# EAGLE design relay-v1 (EAGLE 7.7.0)
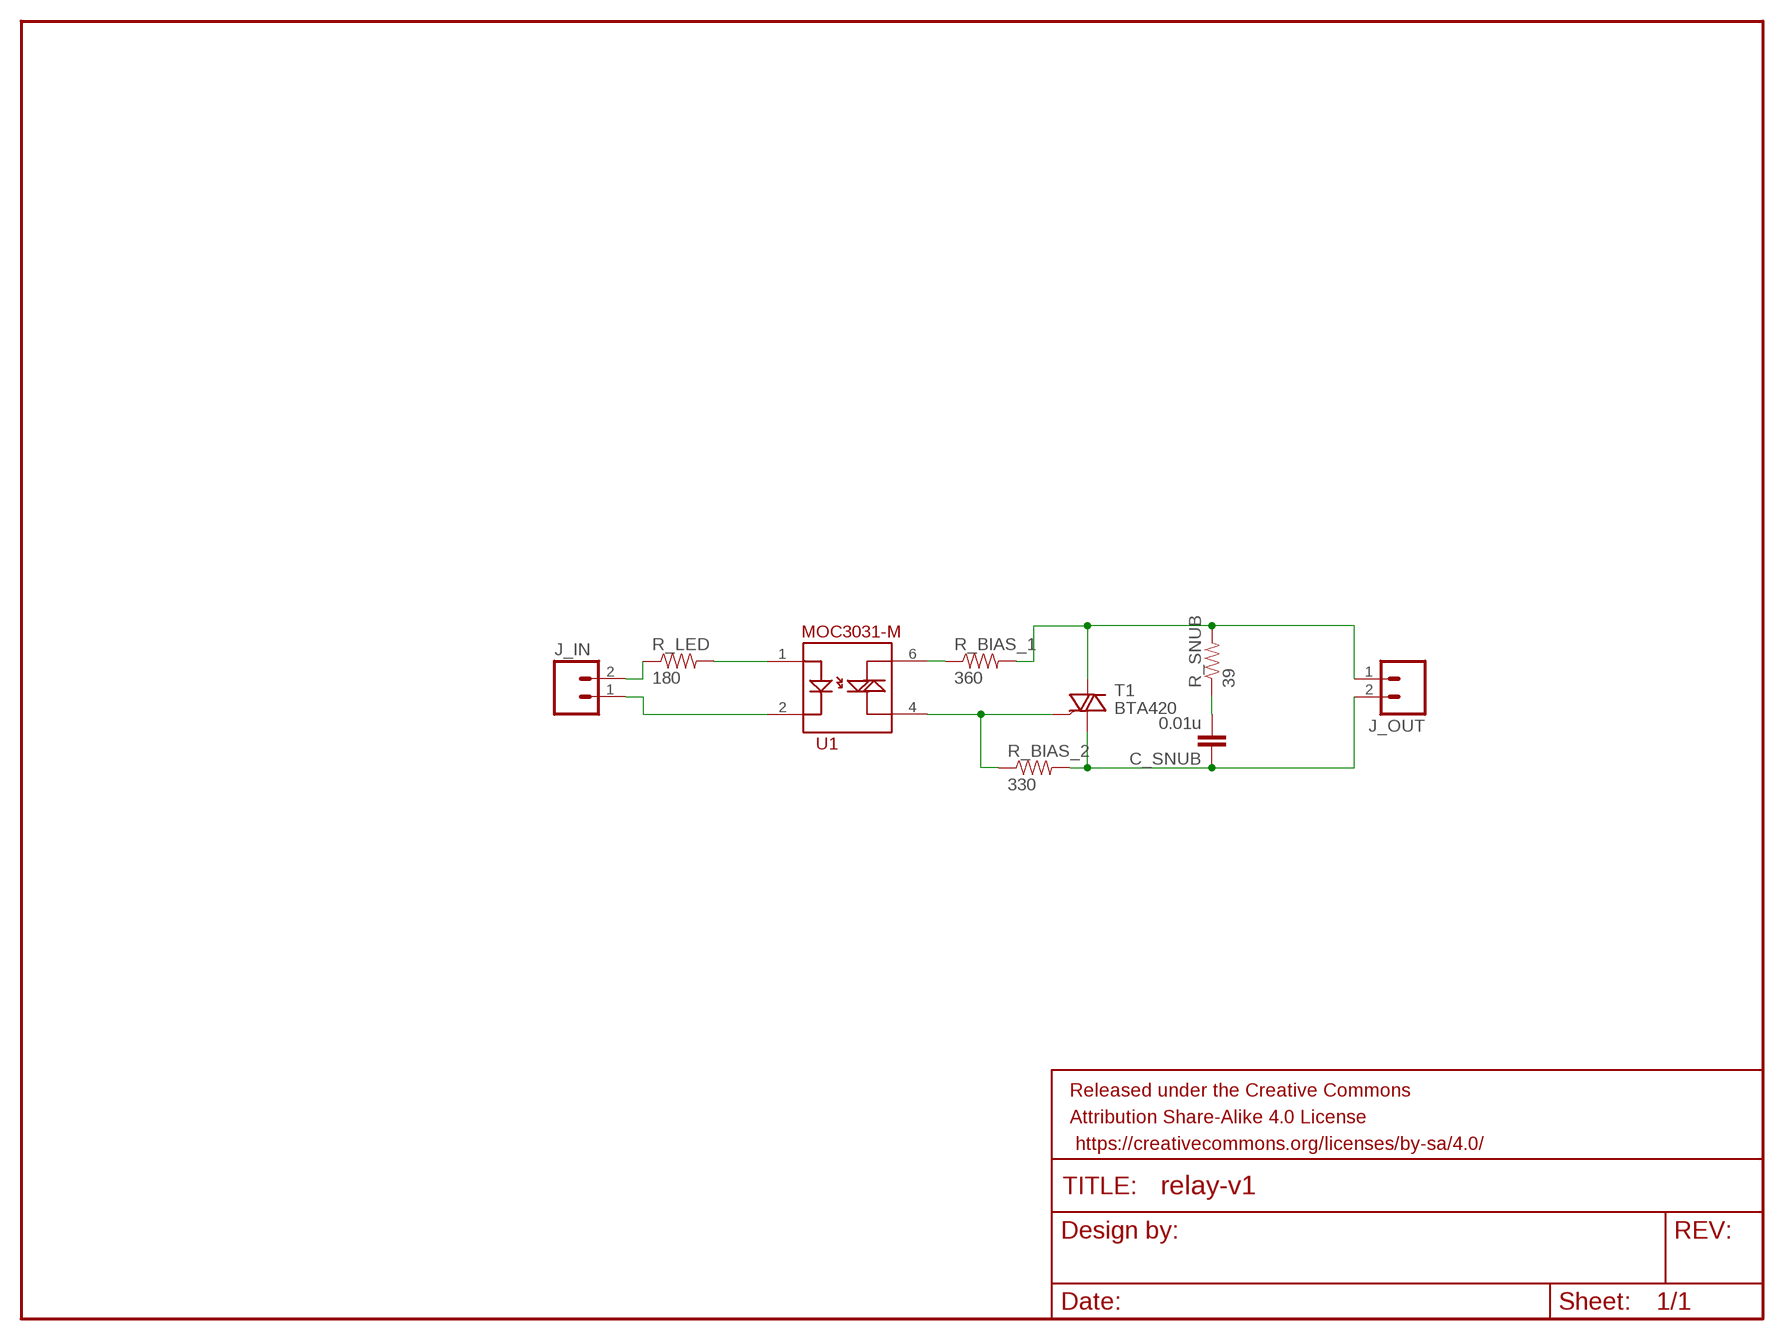
[diagram p0: schematic, sheet 1]

## Parts
C_SNUB  0.01u  CAPEZ  [CAP-PTH-SMALLEZ]
FRAME1  FRAME-LETTERNO_PACKAGE  [DUMMY]
J_IN  M02PTH  [1X02]
J_OUT  M025MM  [SCREWTERMINAL-5MM-2]
R_BIAS_1  360  RESISTORPTH-1/4W  [AXIAL-0.4]
R_BIAS_2  330  RESISTORPTH-1/4W  [AXIAL-0.4]
R_LED  180  RESISTORPTH-1/4W  [AXIAL-0.4]
R_SNUB  39  RESISTORPTH-1/4W  [AXIAL-0.4]
T1  BTA420  BT138-V  [TO220BV]
U1  MOC3063M  MOC3031-M  [DIL06]

## Nets
DEVICE: J_OUT.1 R_BIAS_1.P$2 R_SNUB.P$2 T1.T2(A2)
LED_MINUS: J_IN.1 U1.2
LED_PLUS: J_IN.2 R_LED.P$1
N$2: R_LED.P$2 U1.1
N$4: R_BIAS_1.P$1 U1.6
N$5: R_BIAS_2.P$1 T1.G U1.4
N$7: C_SNUB.2 R_SNUB.P$1
POWER: C_SNUB.1 J_OUT.2 R_BIAS_2.P$2 T1.T1(A1)

## Library data of the parts
C_SNUB = SparkFun-Capacitors:CAP: Capacitor Standard 0603 ceramic capacitor, and 0.1" leaded capacitor.
FRAME1 = SparkFun-Aesthetics:FRAME-LETTER: Schematic Frame Standard 8.5x11 US Letter frame; DESIGNER: Nobody; VERSION: v01
J_IN = SparkFun-Connectors:M02: Standard 2-pin 0.1" header. Use with - straight break away headers ( PRT-00116) - right angle break away headers (PRT-00553) - swiss pins (PRT-00743) - machine pins (PRT-00117) - female headers (PRT-00115) Molex polarized connector foot print use with: PRT-08233 with associated crimp pins and housings. 2.54_SCREWTERM for use with PRT-10571. 3.5mm Screw Terminal footprints for PRT-08084 5mm Screw Terminal footprints for use with PRT-08432
J_OUT = SparkFun-Connectors:M02: Standard 2-pin 0.1" header. Use with - straight break away headers ( PRT-00116) - right angle break away headers (PRT-00553) - swiss pins (PRT-00743) - machine pins (PRT-00117) - female headers (PRT-00115) Molex polarized connector foot print use with: PRT-08233 with associated crimp pins and housings. 2.54_SCREWTERM for use with PRT-10571. 3.5mm Screw Terminal footprints for PRT-08084 5mm Screw Terminal footprints for use with PRT-08432; STOREFRONT_ID: PRT-08432
R_BIAS_1 R_BIAS_2 R_LED R_SNUB = SparkFun-Resistors:RESISTOR: Resistor Basic schematic elements and footprints for 0603, 1206, and PTH resistors.
T1 = triac:BT138: TRIAC Source: http://www.semiconductors.philips.com BT138_SERIES_2.pdf
U1 = SparkFun-DiscreteSemi:MOC3031-M: Opto-isolated TRIAC

## Net classes
0 default: clearance 0.205 mm

## Board
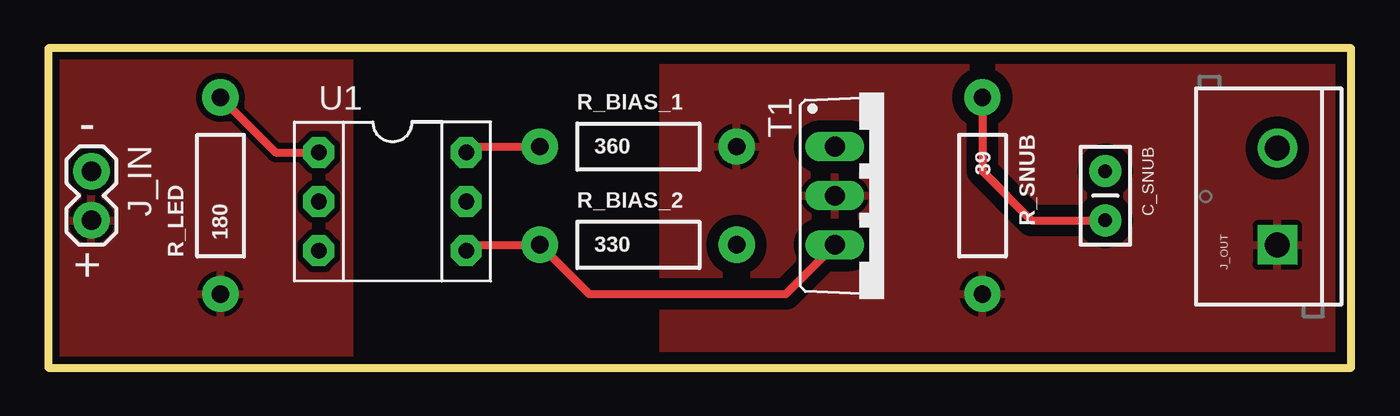
[diagram p1: board, top side]
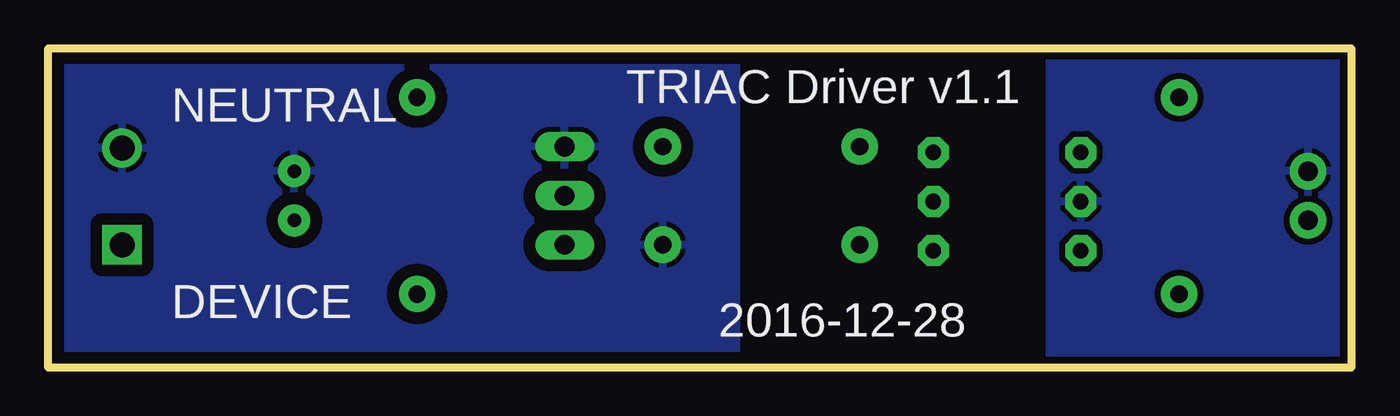
[diagram p2: board, bottom side, seen from below]

Size 67.31 x 16.51 mm. Coordinates in mm from the lower left corner, seen from the top.
Outline: 0,0 67.31,0 67.31,16.51 0,16.51 0,0
Copper layers (1*16): Top 0.0356mm / dielectric 1.5011mm / Bottom 0.0356mm
Design rules "oshpark-2layer": minimum track width 6mil, minimum drill 13mil, track to track 6mil, track to pad 6mil, pad to pad 6mil, via to via 6mil, smd to smd 6mil, copper to edge 15mil, drill to drill 6mil, minimum pad ring 7mil, minimum via ring 7mil, stop-mask expansion 2.5mil, vias tented up to drill 0mil, thermal gap 10mil

### Footprints (pad centres in the part's own frame; a part is rotated, then mirrored left to right if it is on the bottom)
CAP-PTH-SMALLEZ = drill 0.7 pad 1.651: 1 0,0; 2 2.54,0
1X02 = drill 1.016 pad 1.88: 1 0,0; 2 2.54,0
SCREWTERMINAL-5MM-2 = drill 1.3 pad 2.032 square: 1 0,0 | drill 1.3 pad 2.032: 2 5,0
AXIAL-0.4 = drill 0.9 pad 1.88: P$1 -5.08,0; P$2 5.08,0
TO220BV = drill 1.016 long: G 2.54,-2.54; T1 -2.54,-2.54; T2 0,-2.54
DIL06 = drill 0.813 pad 1.6 octagon: 1 -3.51,-3.81; 2 -0.97,-3.81; 3 1.57,-3.81; 4 1.57,3.81; 5 -0.97,3.81; 6 -3.51,3.81

### Placement (x,y rotation side)
C_SNUB  54.61,10.16 270 top
FRAME1  -16.51,-20.32 0 top  (outside the outline)
J_IN  2.22,10.16 270 top
J_OUT  63.5,6.35 90 top
R_BIAS_1  30.48,11.43 0 top
R_BIAS_2  30.48,6.35 0 top
R_LED  8.89,8.89 90 top
R_SNUB  48.26,8.89 270 top
T1  43.18,8.89 270 top
U1  17.78,7.62 270 top

### Tracks (layer width: path | path; a pad name or v marks a point on that pad's centre or on a via)
DEVICE
  pour Top (isolate 0.61): 31.75,16.51 31.75,0 67.31,0 67.31,16.51
LED_MINUS
  pour Bottom (isolate 0.305): 0,16.51 0,0 15.56,0 15.56,16.51
LED_PLUS
  pour Top (isolate 0.305): 0,16.51 0,0 15.56,0 15.56,16.51
N$2
  Top 0.406: R_LED.P$2 11.73,11.13 U1.1
N$4
  Top 0.406: U1.6 21.89,11.43 R_BIAS_1.P$1
N$5
  Top 0.406: U1.4 21.89,6.35 R_BIAS_2.P$1 27.94,3.81 38.1,3.81 T1.G
N$7
  Top 0.406: R_SNUB.P$1 48.26,10.16 50.8,7.62 C_SNUB.2
POWER
  pour Bottom (isolate 0.61): 31.75,0 31.75,16.51 67.31,16.51 67.31,0

### Text on the board
tPlace: - | +
bPlace: TRIAC Driver v1.1 | NEUTRAL | DEVICE | 2016-12-28